# Altium schematic sheet 5.SchDoc
size 594 x 420 mm
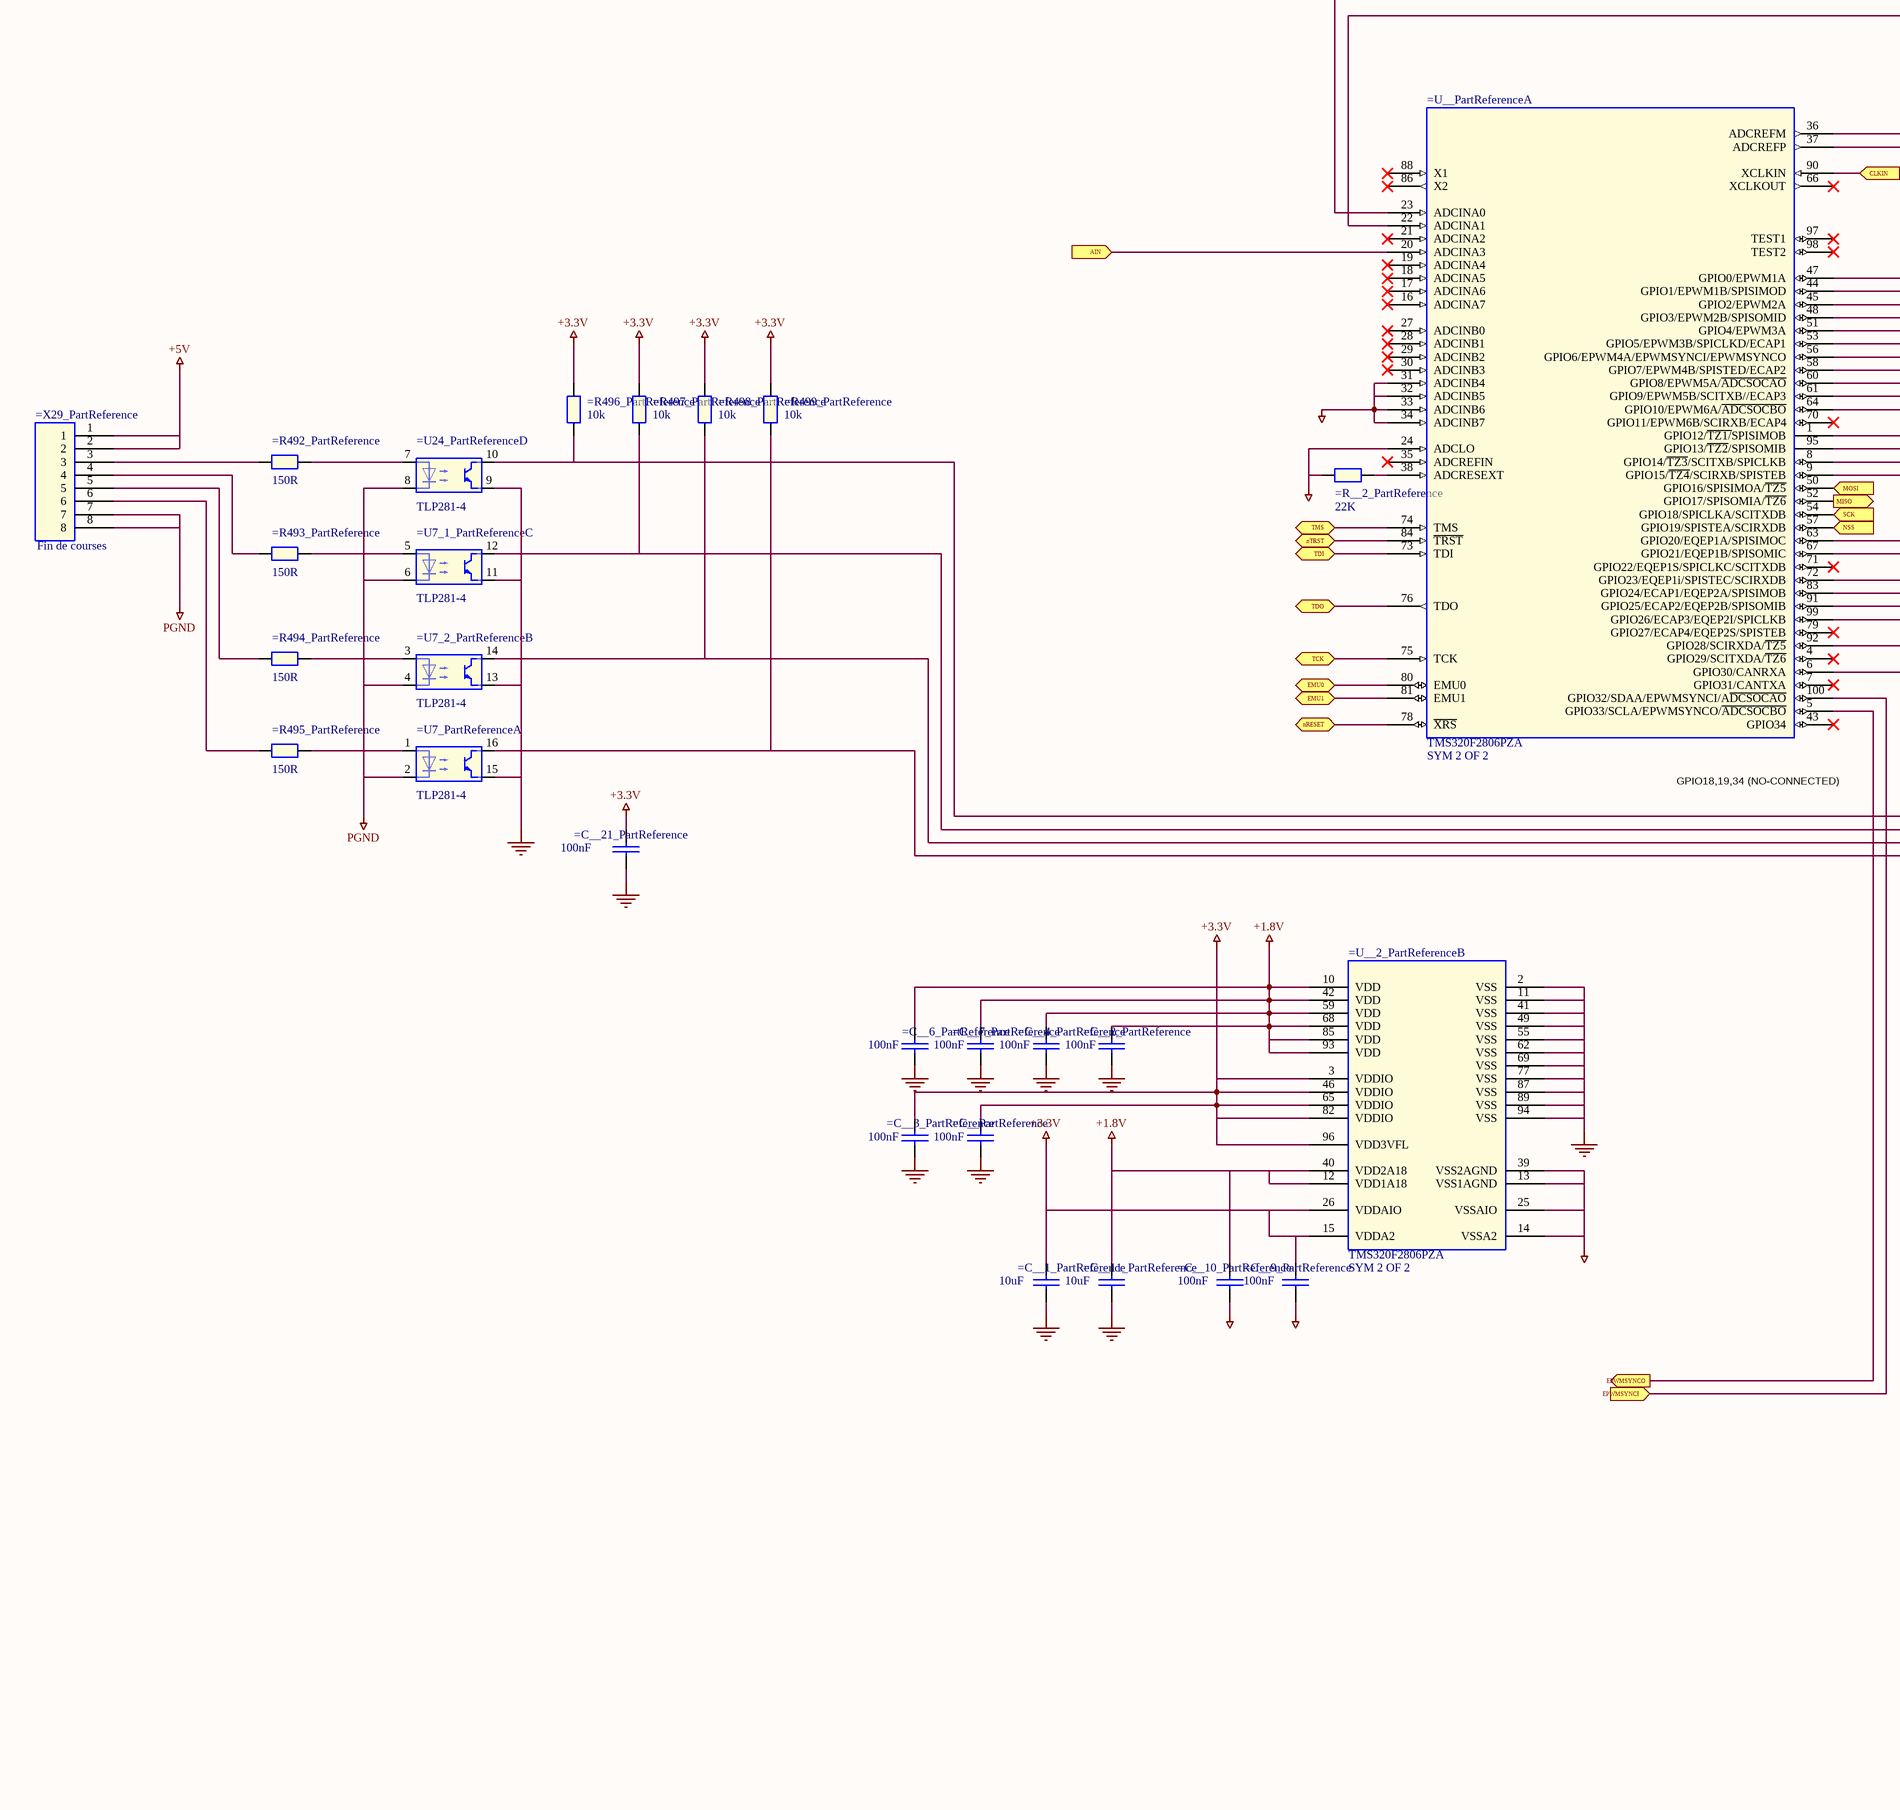
[diagram p0: 5.SchDoc, left]
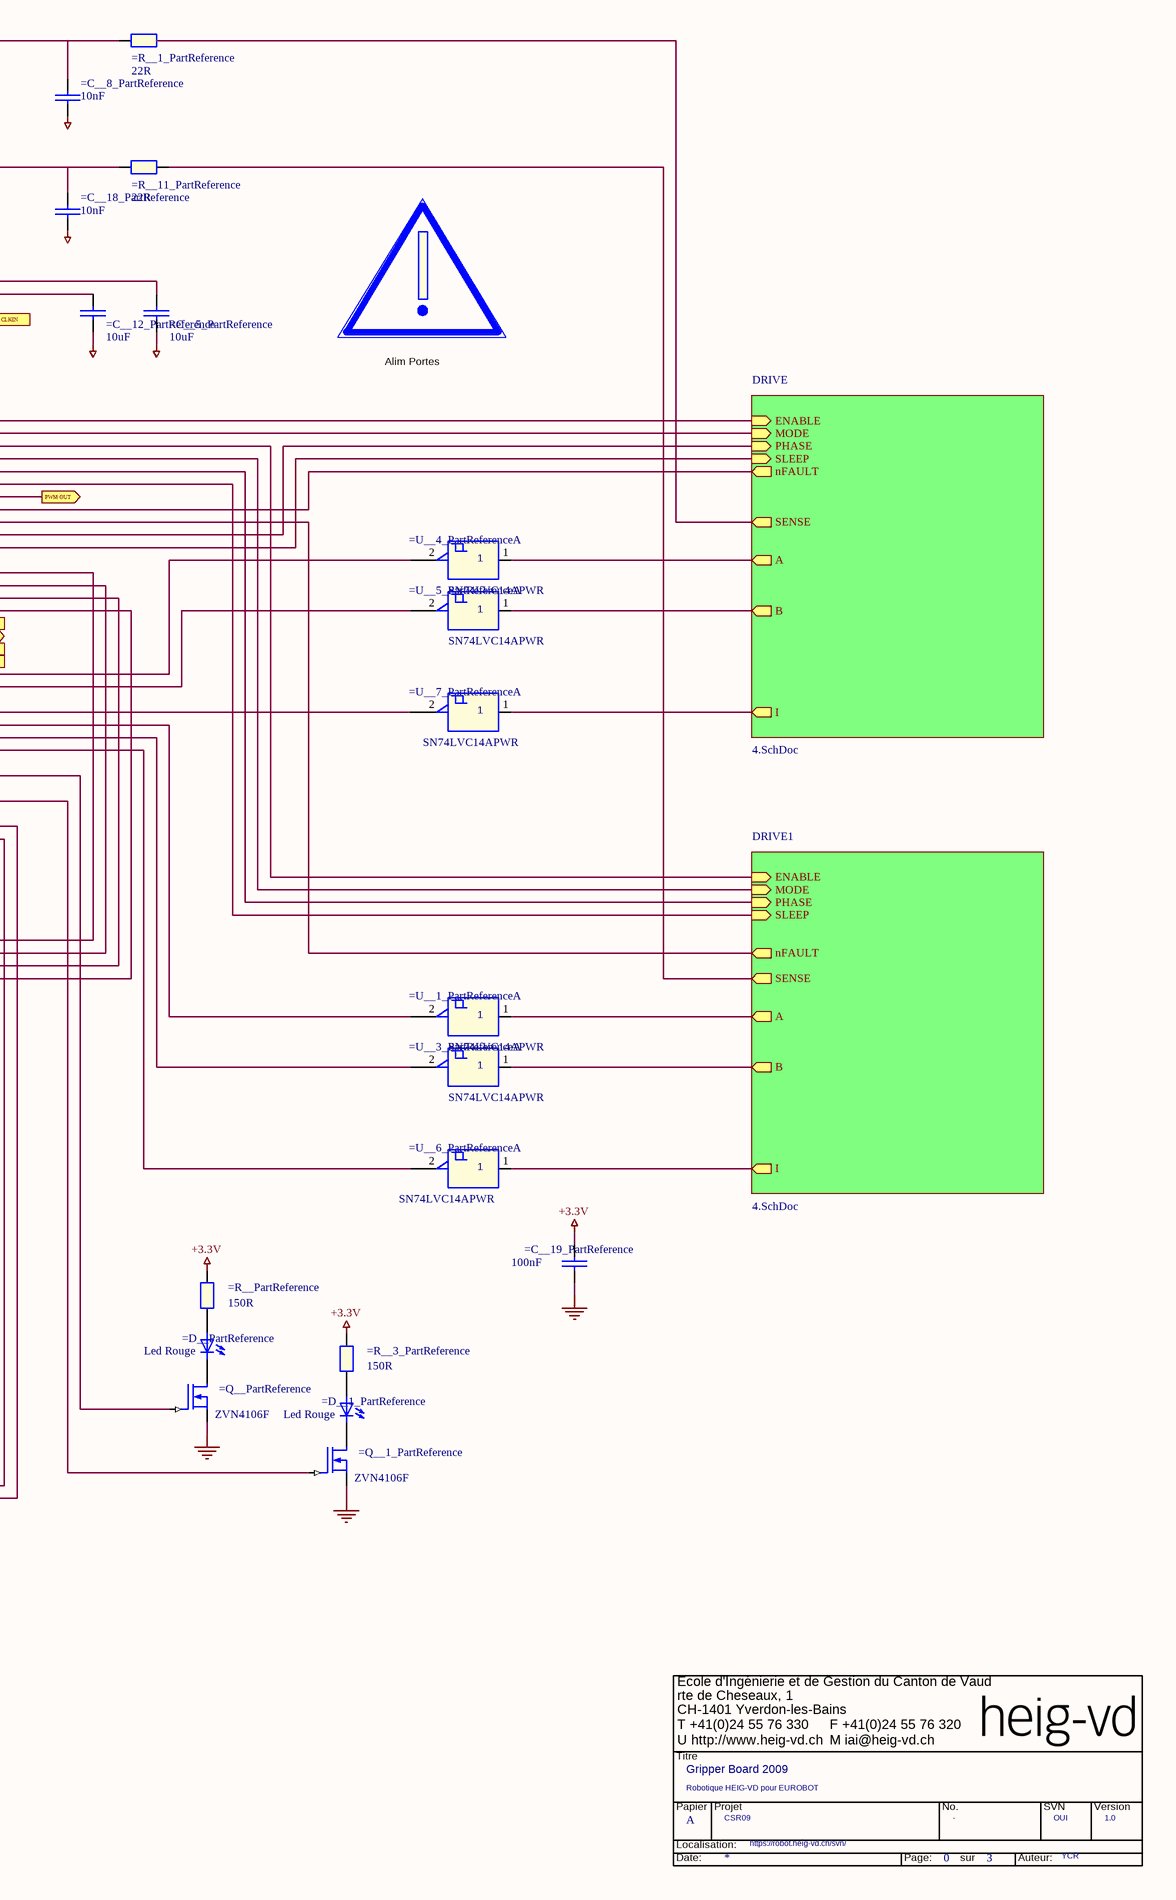
[diagram p1: 5.SchDoc, right]

## Parts
*  RevCode: 1.0  Title: Gripper Board 2009  Page Size: A  Page Number: 0  Page Count: 3  Projet: CSR09  Subtitle: Robotique HEIG-VD pour EUROBOT  Author: YCR  SVN: OUI  (hidden comment: TitleBlock HEIG-VD)  (graphical)
=C__1_PartReference  10uF  [SM/C_0805]
=C__2_PartReference  100nF  [SM/C_0805]
=C__3_PartReference  100nF  [SM/C_0805]
=C__4_PartReference  100nF  [SM/C_0805]
=C__5_PartReference  10uF  [SM/C_0805]
=C__6_PartReference  100nF  [SM/C_0805]
=C__7_PartReference  100nF  [SM/C_0805]
=C__8_PartReference  10nF  [SM/C_0805]
=C__9_PartReference  100nF  [SM/C_0805]
=C__10_PartReference  100nF  [SM/C_0805]
=C__11_PartReference  10uF  [SM/C_0805]
=C__12_PartReference  10uF  [SM/C_0805]
=C__18_PartReference  10nF  [SM/C_0805]
=C__19_PartReference  100nF  [SM/C_0805]
=C__21_PartReference  100nF  [SM/C_0805]
=C__PartReference  100nF  [SM/C_0805]
=D__1_PartReference  Led Rouge  [LED 5]
=D__PartReference  Led Rouge  [LED 5]
=Q__1_PartReference  ZVN4106F  [SM/SOT23_123]
=Q__PartReference  ZVN4106F  [SM/SOT23_123]
=R492_PartReference  150R  [R400]
=R493_PartReference  150R  [R400]
=R494_PartReference  150R  [R400]
=R495_PartReference  150R  [R400]
=R496_PartReference  10k  [R400]
=R497_PartReference  10k  [R400]
=R498_PartReference  10k  [R400]
=R499_PartReference  10k  [R400]
=R__1_PartReference  22R  [R400]
=R__2_PartReference  22K  [R400]
=R__3_PartReference  150R  [R400]
=R__11_PartReference  22R  [R400]
=R__PartReference  150R  [R400]
=U7_1_PartReference  TLP281-4  [HEIG/SM/SOIC16/7.0M]  (part C of 4)
=U7_2_PartReference  TLP281-4  [HEIG/SM/SOIC16/7.0M]  (part B of 4)
=U7_PartReference  TLP281-4  [HEIG/SM/SOIC16/7.0M]  (part A of 4)
=U24_PartReference  TLP281-4  [HEIG/SM/SOIC16/7.0M]  (part D of 4)
=U__1_PartReference  SN74LVC14APWR  [HEIG/SM/SOIC14]  (part A of 6)
=U__2_PartReference  SlotXofY: SYM 2 OF 2  [QUAD.50M/100/WG16.00]  (hidden comment: tms320f2806pza)  (part B of 2)
=U__3_PartReference  SN74LVC14APWR  [HEIG/SM/SOIC14]  (part A of 6)
=U__4_PartReference  SN74LVC14APWR  [HEIG/SM/SOIC14]  (part A of 6)
=U__5_PartReference  SN74LVC14APWR  [HEIG/SM/SOIC14]  (part A of 6)
=U__6_PartReference  SN74LVC14APWR  [HEIG/SM/SOIC14]  (part A of 6)
=U__7_PartReference  SN74LVC14APWR  [HEIG/SM/SOIC14]  (part A of 6)
=U__PartReference  SlotXofY: SYM 2 OF 2  [QUAD.50M/100/WG16.00]  (hidden comment: tms320f2806pza)  (part A of 2)
=WARNING1_PartReference  WARNING  (value not drawn)
=X29_PartReference  Fin de courses  [HEIG/WAGO/733-338]

## Sub-sheets
DRIVE = 4.SchDoc: SLEEP (in), ENABLE (in), MODE (in), nFAULT (out), I (out), PHASE (in), A (out), B (out), SENSE (out)  | ReuseAnnotated: YES; X__PartReference: =DRIVE_X__PartReference; C__15_PartReference: =DRIVE_C__15_PartReference; U__9_PartReference: =DRIVE_U__9_PartReference; C__13_PartReference: =DRIVE_C__13_PartReference; C__16_PartReference: =DRIVE_C__16_PartReference; R__10_PartReference: =DRIVE_R__10_PartReference; C__17_PartReference: =DRIVE_C__17_PartReference; C__20_PartReference: =DRIVE_C__20_PartReference; R__6_PartReference: =DRIVE_R__6_PartReference; R__9_PartReference: =DRIVE_R__9_PartReference; U6_PartReference: =DRIVE_U6_PartReference; R__4_PartReference: =DRIVE_R__4_PartReference; C__14_PartReference: =DRIVE_C__14_PartReference; R__8_PartReference: =DRIVE_R__8_PartReference; R__7_PartReference: =DRIVE_R__7_PartReference; U__8_PartReference: =DRIVE_U__8_PartReference; R__5_PartReference: =DRIVE_R__5_PartReference; TitleBlock_3_Page_Number: =DRIVE_TitleBlock_3_Page_Number
DRIVE1 = 4.SchDoc: SLEEP (in), ENABLE (in), MODE (in), nFAULT (out), I (out), PHASE (in), A (out), B (out), SENSE (out)  | ReuseAnnotated: YES; X__PartReference: =DRIVE1_X__PartReference; C__15_PartReference: =DRIVE1_C__15_PartReference; U__9_PartReference: =DRIVE1_U__9_PartReference; C__13_PartReference: =DRIVE1_C__13_PartReference; C__16_PartReference: =DRIVE1_C__16_PartReference; R__10_PartReference: =DRIVE1_R__10_PartReference; C__17_PartReference: =DRIVE1_C__17_PartReference; C__20_PartReference: =DRIVE1_C__20_PartReference; R__6_PartReference: =DRIVE1_R__6_PartReference; R__9_PartReference: =DRIVE1_R__9_PartReference; U6_PartReference: =DRIVE1_U6_PartReference; R__4_PartReference: =DRIVE1_R__4_PartReference; C__14_PartReference: =DRIVE1_C__14_PartReference; R__8_PartReference: =DRIVE1_R__8_PartReference; R__7_PartReference: =DRIVE1_R__7_PartReference; U__8_PartReference: =DRIVE1_U__8_PartReference; R__5_PartReference: =DRIVE1_R__5_PartReference; TitleBlock_3_Page_Number: =DRIVE1_TitleBlock_3_Page_Number

## Ports
AIN (in), CLKIN (in), EMU0 (bidir), EMU1 (bidir), EPWMSYNCI (in), EPWMSYNCO (out), MISO (out), MOSI (in), nRESET (bidir), NSS (in), nTRST (bidir), PWM OUT (out), SCK (in), TCK (bidir), TDI (bidir), TDO (bidir), TMS (bidir)

## Nets
+1.8V: =C__2_PartReference.1 =C__4_PartReference.1 =C__6_PartReference.1 =C__7_PartReference.1 =C__10_PartReference.1 =C__11_PartReference.1 =U__2_PartReference.10(VDD) =U__2_PartReference.12(VDD1A18) =U__2_PartReference.40(VDD2A18) =U__2_PartReference.42(VDD) =U__2_PartReference.59(VDD) =U__2_PartReference.68(VDD) =U__2_PartReference.85(VDD) =U__2_PartReference.93(VDD)
+3.3V: =C__1_PartReference.1 =C__3_PartReference.1 =C__9_PartReference.1 =C__19_PartReference.1 =C__21_PartReference.1 =C__PartReference.1 =R496_PartReference.1 =R497_PartReference.1 =R498_PartReference.1 =R499_PartReference.1 =R__3_PartReference.1 =R__PartReference.1 =U__1_PartReference.14(+3.3V) =U__2_PartReference.3(VDDIO) =U__2_PartReference.15(VDDA2) =U__2_PartReference.26(VDDAIO) =U__2_PartReference.46(VDDIO) =U__2_PartReference.65(VDDIO) =U__2_PartReference.82(VDDIO) =U__2_PartReference.96(VDD3VFL) =U__3_PartReference.14(+3.3V) =U__4_PartReference.14(+3.3V) =U__5_PartReference.14(+3.3V) =U__6_PartReference.14(+3.3V) =U__7_PartReference.14(+3.3V)
+5V: =X29_PartReference.1 =X29_PartReference.2
AGND: =C__5_PartReference.2 =C__8_PartReference.2 =C__9_PartReference.2 =C__10_PartReference.2 =C__12_PartReference.2 =C__18_PartReference.2 =R__2_PartReference.1 =U__2_PartReference.13(VSS1AGND) =U__2_PartReference.14(VSSA2) =U__2_PartReference.25(VSSAIO) =U__2_PartReference.39(VSS2AGND) =U__PartReference.24(ADCLO) =U__PartReference.31(ADCINB4) =U__PartReference.32(ADCINB5) =U__PartReference.33(ADCINB6) =U__PartReference.34(ADCINB7)
GND: =C__1_PartReference.2 =C__2_PartReference.2 =C__3_PartReference.2 =C__4_PartReference.2 =C__6_PartReference.2 =C__7_PartReference.2 =C__11_PartReference.2 =C__19_PartReference.2 =C__21_PartReference.2 =C__PartReference.2 =Q__1_PartReference.2(SOURCE) =Q__PartReference.2(SOURCE) =U7_1_PartReference.11(E) =U7_2_PartReference.13(E) =U7_PartReference.15(E) =U24_PartReference.9(E) =U__1_PartReference.7(GND) =U__2_PartReference.2(VSS) =U__2_PartReference.11(VSS) =U__2_PartReference.41(VSS) =U__2_PartReference.49(VSS) =U__2_PartReference.55(VSS) =U__2_PartReference.62(VSS) =U__2_PartReference.69(VSS) =U__2_PartReference.77(VSS) =U__2_PartReference.87(VSS) =U__2_PartReference.89(VSS) =U__2_PartReference.94(VSS) =U__3_PartReference.7(GND) =U__4_PartReference.7(GND) =U__5_PartReference.7(GND) =U__6_PartReference.7(GND) =U__7_PartReference.7(GND)
PGND: =U7_1_PartReference.6(C) =U7_2_PartReference.4(C) =U7_PartReference.2(C) =U24_PartReference.8(C) =X29_PartReference.7 =X29_PartReference.8
AIN: =U__PartReference.20(ADCINA3) ; port AIN
CLKIN: =U__PartReference.90(XCLKIN) ; port CLKIN
EMU0: =U__PartReference.80(EMU0) ; port EMU0
EMU1: =U__PartReference.81(EMU1) ; port EMU1
EPWMSYNCI: =U__PartReference.100(GPIO32/SDAA/EPWMSYNCI/A~{DCSOCAO}) ; port EPWMSYNCI
EPWMSYNCO: =U__PartReference.5(GPIO33/SCLA/EPWMSYNCO/~{ADCSOCBO}) ; port EPWMSYNCO
MISO: =U__PartReference.52(GPIO17/SPISOMIA/~{TZ6}) ; port MISO
MOSI: =U__PartReference.50(GPIO16/SPISIMOA/~{TZ5}) ; port MOSI
nRESET: =U__PartReference.78(~{XRS}) ; port nRESET
NSS: =U__PartReference.57(GPIO19/SPISTEA/SCIRXDB) ; port NSS
nTRST: =U__PartReference.84(~{TRST}) ; port nTRST
PWM OUT: =U__PartReference.56(GPIO6/EPWM4A/EPWMSYNCI/EPWMSYNCO) ; port PWM OUT
SCK: =U__PartReference.54(GPIO18/SPICLKA/SCITXDB) ; port SCK
TCK: =U__PartReference.75(TCK) ; port TCK
TDI: =U__PartReference.73(TDI) ; port TDI
TDO: =U__PartReference.76(TDO) ; port TDO
TMS: =U__PartReference.74(TMS) ; port TMS
Net=C__5_PartReference_1: =C__5_PartReference.1 =U__PartReference.36(ADCREFM)
Net=C__8_PartReference_1: =C__8_PartReference.1 =R__1_PartReference.2 =U__PartReference.23(ADCINA0)
Net=C__12_PartReference_1: =C__12_PartReference.1 =U__PartReference.37(ADCREFP)
Net=C__18_PartReference_1: =C__18_PartReference.1 =R__11_PartReference.2 =U__PartReference.22(ADCINA1)
Net=D__1_PartReference_1: =D__1_PartReference.1 =Q__1_PartReference.3(DRAIN)
Net=D__1_PartReference_2: =D__1_PartReference.2 =R__3_PartReference.2
Net=D__PartReference_1: =D__PartReference.1 =Q__PartReference.3(DRAIN)
Net=D__PartReference_2: =D__PartReference.2 =R__PartReference.2
Net=Q__1_PartReference_1: =Q__1_PartReference.1(GATE) =U__PartReference.6(GPIO30/CANRXA)
Net=Q__PartReference_1: =Q__PartReference.1(GATE) =U__PartReference.92(GPIO28/SCIRXDA/~{TZ5})
Net=R492_PartReference_1: =R492_PartReference.1 =X29_PartReference.3
Net=R492_PartReference_2: =R492_PartReference.2 =U24_PartReference.7(A)
Net=R493_PartReference_1: =R493_PartReference.1 =X29_PartReference.4
Net=R493_PartReference_2: =R493_PartReference.2 =U7_1_PartReference.5(A)
Net=R494_PartReference_1: =R494_PartReference.1 =X29_PartReference.5
Net=R494_PartReference_2: =R494_PartReference.2 =U7_2_PartReference.3(A)
Net=R495_PartReference_1: =R495_PartReference.1 =X29_PartReference.6
Net=R495_PartReference_2: =R495_PartReference.2 =U7_PartReference.1(A)
Net=R496_PartReference_2: =R496_PartReference.2 =U24_PartReference.10(COL) =U__PartReference.1(GPIO12/~{TZ1/}SPISIMOB)
Net=R497_PartReference_2: =R497_PartReference.2 =U7_1_PartReference.12(COL) =U__PartReference.95(GPIO13/~{TZ2}/SPISOMIB)
Net=R498_PartReference_2: =R498_PartReference.2 =U7_2_PartReference.14(COL) =U__PartReference.8(GPIO14/~{TZ3}/SCITXB/SPICLKB)
Net=R499_PartReference_2: =R499_PartReference.2 =U7_PartReference.16(COL) =U__PartReference.9(GPIO15/~{TZ4}/SCIRXB/SPISTEB)
Net=R__1_PartReference_1: =R__1_PartReference.1 ; sheet DRIVE/SENSE
Net=R__2_PartReference_2: =R__2_PartReference.2 =U__PartReference.38(ADCRESEXT)
Net=R__11_PartReference_1: =R__11_PartReference.1 ; sheet DRIVE1/SENSE
Net=U__1_PartReference_1: =U__1_PartReference.1(6A) ; sheet DRIVE1/A
Net=U__1_PartReference_2: =U__1_PartReference.2(6Y) =U__PartReference.83(GPIO24/ECAP1/EQEP2A/SPISIMOB)
Net=U__3_PartReference_1: =U__3_PartReference.1(6A) ; sheet DRIVE1/B
Net=U__3_PartReference_2: =U__3_PartReference.2(6Y) =U__PartReference.91(GPIO25/ECAP2/EQEP2B/SPISOMIB)
Net=U__4_PartReference_1: =U__4_PartReference.1(6A) ; sheet DRIVE/A
Net=U__4_PartReference_2: =U__4_PartReference.2(6Y) =U__PartReference.63(GPIO20/EQEP1A/SPISIMOC)
Net=U__5_PartReference_1: =U__5_PartReference.1(6A) ; sheet DRIVE/B
Net=U__5_PartReference_2: =U__5_PartReference.2(6Y) =U__PartReference.67(GPIO21/EQEP1B/SPISOMIC)
Net=U__6_PartReference_1: =U__6_PartReference.1(6A) ; sheet DRIVE1/I
Net=U__6_PartReference_2: =U__6_PartReference.2(6Y) =U__PartReference.99(GPIO26/ECAP3/EQEP2I/SPICLKB)
Net=U__7_PartReference_1: =U__7_PartReference.1(6A) ; sheet DRIVE/I
Net=U__7_PartReference_2: =U__7_PartReference.2(6Y) =U__PartReference.72(GPIO23/EQEP1i/SPISTEC/SCIRXDB)
Net=U__PartReference_44: =U__PartReference.44(GPIO1/EPWM1B/SPISIMOD) ; sheet DRIVE/MODE
Net=U__PartReference_45: =U__PartReference.45(GPIO2/EPWM2A) ; sheet DRIVE1/ENABLE
Net=U__PartReference_47: =U__PartReference.47(GPIO0/EPWM1A) ; sheet DRIVE/ENABLE
Net=U__PartReference_48: =U__PartReference.48(GPIO3/EPWM2B/SPISOMID) ; sheet DRIVE1/MODE
Net=U__PartReference_51: =U__PartReference.51(GPIO4/EPWM3A) ; sheet DRIVE1/PHASE
Net=U__PartReference_53: =U__PartReference.53(GPIO5/EPWM3B/SPICLKD/ECAP1) ; sheet DRIVE1/SLEEP
Net=U__PartReference_58: =U__PartReference.58(GPIO7/EPWM4B/SPISTED/ECAP2) ; sheet DRIVE/nFAULT
Net=U__PartReference_60: =U__PartReference.60(GPIO8/EPWM5A/~{ADCSOCAO}) ; sheet DRIVE1/nFAULT
Net=U__PartReference_61: =U__PartReference.61(GPIO9/EPWM5B/SCITXB//ECAP3) ; sheet DRIVE/PHASE
Net=U__PartReference_64: =U__PartReference.64(GPIO10/EPWM6A/~{ADCSOCBO}) ; sheet DRIVE/SLEEP

Not connected (* = marked no-connect by the designer): =U__PartReference 4(GPIO29/SCITXDA/~{TZ6})* 7(GPIO31/CANTXA)* 16(ADCINA7)* 17(ADCINA6)* 18(ADCINA5)* 19(ADCINA4)* 21(ADCINA2)* 27(ADCINB0)* 28(ADCINB1)* 29(ADCINB2)* 30(ADCINB3)* 35(ADCREFIN)* 43(GPIO34)* 66(XCLKOUT)* 70(GPIO11/EPWM6B/SCIRXB/ECAP4)* 71(GPIO22/EQEP1S/SPICLKC/SCITXDB)* 79(GPIO27/ECAP4/EQEP2S/SPISTEB)* 86(X2)* 88(X1)* 97(TEST1)* 98(TEST2)*

## Notes on the sheet
- Alim Portes
- GPIO18,19,34 (NO-CONNECTED)
- (in symbol TitleBlock HEIG-VD) Ecole d'Ingénierie et de Gestion du Canton de Vaud; rte de Cheseaux, 1; CH-1401 Yverdon-les-Bains; T +41(0)24 55 76 330; F +41(0)24 55 76 320; U http://www.heig-vd.ch; M iai@heig-vd.ch; Titre; Papier; Projet; No.; SVN; Version; Localisation:; Date:; Page:; sur; Auteur:

## Library data of the parts
* = TitleBlock HEIG-VD: OrgName: Yves Chevallier; OrgAddr1: Ecole d'Ingenierie et du Canton de Vaud; OrgAddr2: route de Cheseaux, 1; OrgAddr3: 1400 Yverdon-les-Bains; Page Create Date: March  8, 1995; No Projet: -; Location: https://robot.heig-vd.ch/svn/; Page Modify Date: *; Page_Number: =TitleBlock_Page_Number
=C__1_PartReference =C__3_PartReference =C__6_PartReference =C__9_PartReference =C__10_PartReference =C__11_PartReference =C__PartReference = C_Dup1: Ref. Fabricant: PHYCOMP; Prix: 0.06; Ref. Fab: AVX; PCB Footprint: HEIG/SM/C_0805; Distributeur: Farnell; Ref. Distributeur: 432210; Distributor: Farnell; Price in €: 0.140; Ref. Distributor: 499-687
=C__2_PartReference =C__4_PartReference =C__7_PartReference =C__8_PartReference =C__18_PartReference =C__19_PartReference =C__21_PartReference = C_Dup1: Ref. Fab: AVX; Prix: 0.06; Ref. Fabricant: PHYCOMP; PCB Footprint: HEIG/SM/C_0805; Ref. Distributor: 499-687; Price in €: 0.140; Distributor: Farnell; Ref. Distributeur: 432210; Distributeur: Farnell
=C__5_PartReference =C__12_PartReference = C_Dup1: fab: B45196-E2225K109; Prix Unitaire: 0.40; Designation: Tantale standard; Référence: 757-720; VOLTAGE: 10V; Ref. Fab: AVXMCCTA106M006.MULTICOMP; Prix: 0.36; Ref. Fabricant: AVX; PCB Footprint: HEIG/SM/C_0805; Distributor: Farnell; Ref. Distributor: 967-014; Price in €: 0.87; Ref. Distributeur: 498660; Distributeur: Farnell
=D__1_PartReference = Led_0: Ref. Fab: QTLP670C-2... FAIRCHILD SEMICONDUCTOR; Ref. Fabricant: VISHAY TLMT3100-GS08; Prix: 0.20; PCB Footprint: HEIG/SM/D_0805; Distributor: Farnell; Ref. Distributor: 3599917; Price in €: 0.144; Ref. Distributeur: 8311510; Distributeur: Farnell
=D__PartReference = Led_0: Prix: 0.20; Ref. Fabricant: VISHAY TLMT3100-GS08; Ref. Fab: QTLP670C-2... FAIRCHILD SEMICONDUCTOR; PCB Footprint: HEIG/SM/D_0805; Distributeur: Farnell; Ref. Distributeur: 8311510; Price in €: 0.144; Ref. Distributor: 3599917; Distributor: Farnell
=Q__1_PartReference = MOSFET N_0: Ref. Fabricant: ZETEX; Prix: 0.54; COMPHEIGHT: 0.000; MEMORY: NO; COMPGROUP: 0; COMPROT: 270; COMPLOC: [1962.500,750.000]; COMPSIDE: TOP; Distributeur: Farnell; Ref. Distributeur: 516650; DECOUPLER: NO; COMPKEY: NO; COMPLOCKED: NO; COMPFIXED: NO; PCB Footprint: SM/SOT23_123
=Q__PartReference = MOSFET N_0: COMPSIDE: TOP; COMPLOC: [1962.500,750.000]; COMPROT: 270; COMPGROUP: 0; COMPFIXED: NO; COMPHEIGHT: 0.000; Prix: 0.54; Ref. Fabricant: ZETEX; COMPLOCKED: NO; COMPKEY: NO; DECOUPLER: NO; MEMORY: NO; Ref. Distributeur: 516650; Distributeur: Farnell; PCB Footprint: SM/SOT23_123
=R492_PartReference =R493_PartReference =R494_PartReference =R495_PartReference = R_Dup3: PCB Footprint: HEIG/SM/R_0805
=R496_PartReference =R497_PartReference =R498_PartReference =R499_PartReference = R: PCB Footprint: HEIG/SM/R_0805
=R__1_PartReference =R__11_PartReference = R_Dup3: Ref. Fabricant: MULTICOMP; Prix: 0.028; PCB Footprint: HEIG/SM/R_0805; Distributeur: Farnell; Ref. Distributeur: 9331751
=R__2_PartReference = R_Dup3: PCB Footprint: HEIG/SM/R_0805; Ref. Fab: multicomp; Prix: 0.028; Distributor: Farnell; Price in €: 0.037; Ref. Distributor: 613-861; Ref. Distributeur: 9331921; Distributeur: Farnell; Ref. Fabricant: MULTICOMP
=R__3_PartReference = R_Dup3: Tolerance: 0.1%; Ref. Fab: multicomp; Prix: 0.028; PCB Footprint: HEIG/SM/R_0805; Ref. Distributor: 613-587; Price in €: 0.037; Distributor: Farnell; Distributeur: Farnell; Ref. Distributeur: 9331794; Ref. Fabricant: MULTICOMP
=R__PartReference = R_Dup3: Ref. Fabricant: MULTICOMP; Prix: 0.028; Tolerance: 0.1%; PCB Footprint: HEIG/SM/R_0805; Ref. Distributeur: 9331794; Distributeur: Farnell; Distributor: Farnell; Ref. Fab: multicomp; Price in €: 0.037; Ref. Distributor: 613-587
=U__1_PartReference = 7414_7: Prix: 0.953; Ref. Fabricant: SN74LVC14AD; Fabricant: TEXAS INSTRUMENTS; PCB Footprint: HEIG/SM/SOIC14; Ref. Distributeur: 1102973; Distributeur: Farnell; Distributor: Spoerle
=U__2_PartReference =U__PartReference = TMS320F2806PZA_0: Instance: ?; BoardLocation: ?; RefLocation: ?; SymName: TMS320F2806PZA; Ref. Fab: TMS 320 F2806 PZA; Distributor: Spoerle; Ref. Distributor: 214162; Price in €: 22.2; PCB Footprint: QUAD.50M/100/WG16.00
=U__3_PartReference = 7414_8: Prix: 0.953; Ref. Fabricant: SN74LVC14AD; Fabricant: TEXAS INSTRUMENTS; PCB Footprint: HEIG/SM/SOIC14; Ref. Distributeur: 1102973; Distributeur: Farnell; Distributor: Spoerle
=U__4_PartReference = 7414_4: Prix: 0.953; Ref. Fabricant: SN74LVC14AD; Fabricant: TEXAS INSTRUMENTS; PCB Footprint: HEIG/SM/SOIC14; Ref. Distributeur: 1102973; Distributeur: Farnell; Distributor: Spoerle
=U__5_PartReference = 7414_5: Fabricant: TEXAS INSTRUMENTS; Ref. Fabricant: SN74LVC14AD; Prix: 0.953; PCB Footprint: HEIG/SM/SOIC14; Distributor: Spoerle; Distributeur: Farnell; Ref. Distributeur: 1102973
=U__6_PartReference = 7414_9: Fabricant: TEXAS INSTRUMENTS; Ref. Fabricant: SN74LVC14AD; Prix: 0.953; PCB Footprint: HEIG/SM/SOIC14; Distributor: Spoerle; Distributeur: Farnell; Ref. Distributeur: 1102973
=U__7_PartReference = 7414_6: Prix: 0.953; Ref. Fabricant: SN74LVC14AD; Fabricant: TEXAS INSTRUMENTS; PCB Footprint: HEIG/SM/SOIC14; Ref. Distributeur: 1102973; Distributeur: Farnell; Distributor: Spoerle
=X29_PartReference = Connecteur 08: PCB Footprint: HEIG/WAGO/733-338
=U7_1_PartReference =U7_2_PartReference =U7_PartReference =U24_PartReference = TLP281-4: PCB Footprint: HEIG/SM/SOIC16/7.0M